# EAGLE schematic dual_rail_supply (EAGLE 7.5.0)
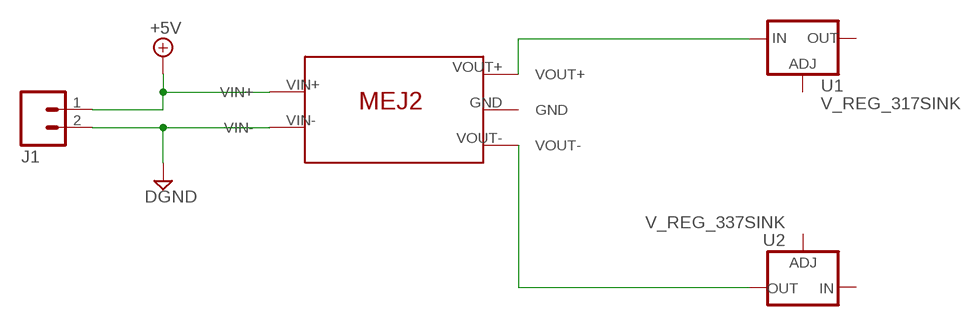
[diagram p0: schematic, sheet 1]

## Parts
J1  M02PTH  [1X02]
U1  V_REG_317SINK  [TO220-ADJ]
U2  V_REG_337SINK  [TO220-ADJ]
U$1  MEJ2D0512SC  [MEJ2]

## Nets
+5V: J1.1
DGND: J1.2
N$1: U1.IN
N$2: U2.OUT
Unconnected: U1.ADJ U1.OUT U2.ADJ U2.IN U$1.GND U$1.VIN+ U$1.VIN- U$1.VOUT+ U$1.VOUT-

## Library data of the parts
J1 = SparkFun-Connectors:M02: Standard 2-pin 0.1" header. Use with - straight break away headers ( PRT-00116) - right angle break away headers (PRT-00553) - swiss pins (PRT-00743) - machine pins (PRT-00117) - female headers (PRT-00115) Molex polarized connector foot print use with: PRT-08233 with associated crimp pins and housings. 2.54_SCREWTERM for use with PRT-10571. 3.5mm Screw Terminal footprints for PRT-08084 5mm Screw Terminal footprints for use with PRT-08432
U1 = SparkFun-PowerIC:V_REG_317: Voltage Regulator Standard LM317 adjustable voltage regulator. AOI (Adjust Output Input). Google 'LM317 Calculator' for easy to use app to get the two resistor values needed. 240/720 for 5V output. 240/390 for 3.3V output. Spark Fun Electronics SKU : COM-00527
U2 = SparkFun-PowerIC:V_REG_337: Voltage Regulator Standard LM337 adjustable negative voltage regulator. AIO (Adjust Input Output). Google 'LM317 Calculator' for easy to use app to get the two resistor values needed. 240/720 for 5V output. 240/390 for 3.3V output.
U$1 = murata-dc-dc-conv:MEJ2D0512SC: Murata Power Solutions 2W Isolated DC-DC Converter, Vin 4.5 → 5.5 V dc, Vout ±12V, I/O isolation 5.2kV dc; VIN: 5; VOUT1: 12; VOUT2: -12